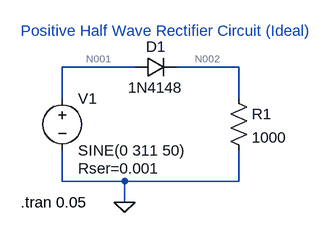
[diagram p0: schematic Assignment 3a (ii).asc]
Assignment 3a (ii).asc, the LTspice schematic file:
Version 4.1
SHEET 1 880 680
WIRE 192 64 80 64
WIRE 352 64 256 64
WIRE 80 112 80 64
WIRE 352 112 352 64
WIRE 80 240 80 192
WIRE 176 240 80 240
WIRE 352 240 352 192
WIRE 352 240 176 240
WIRE 176 272 176 240
FLAG 176 272 0
SYMBOL voltage 80 96 R0
WINDOW 123 0 0 Left 2
WINDOW 39 24 124 Left 2
SYMATTR SpiceLine Rser=0.001
SYMATTR InstName V1
SYMATTR Value SINE(0 311 50)
SYMBOL res 336 96 R0
SYMATTR InstName R1
SYMATTR Value 1000
SYMBOL diode 192 80 R270
WINDOW 0 32 32 VTop 2
WINDOW 3 0 32 VBottom 2
SYMATTR InstName D1
SYMATTR Value 1N4148
TEXT 16 272 Left 2 !.tran 0.05
TEXT 240 8 Center 2 ;Positive Half Wave Rectifier Circuit (Ideal)

The netlist it stands for:
* Assignment 3a (ii).asc
V1 N001 0 SINE(0 311 50) Rser=0.001
R1 N002 0 1000
D1 N001 N002 1N4148
.model D D
.lib standard.dio
.tran 0.05
* Positive Half Wave Rectifier Circuit (Ideal)
.backanno
.end

* Results of the author's LTspice run, read from the files saved beside the schematic
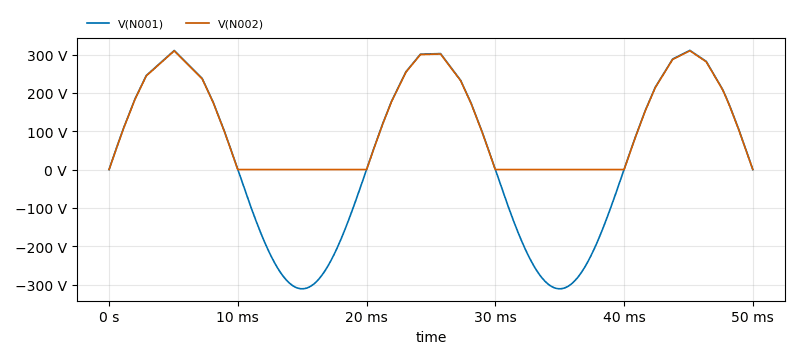
[diagram p1: Transient Analysis of Assignment 3a (ii).asc, plotted from the saved traces]
* Transient Analysis, 1 run:
*   V(N001): min -311 V, max 310.8 V, average 37.54 V, rms 218.1 V, last 0 V
*   V(N002): min -1.584 mV, max 309.8 V, average 116.2 V, rms 167.4 V, last 2.336 mV